# Altium schematic sheet SH3-POWER.SchDoc: SH4-POWER
size Letter; DrawnBy: Christopher Arjune; SheetNumber: 4; SheetTotal: 4
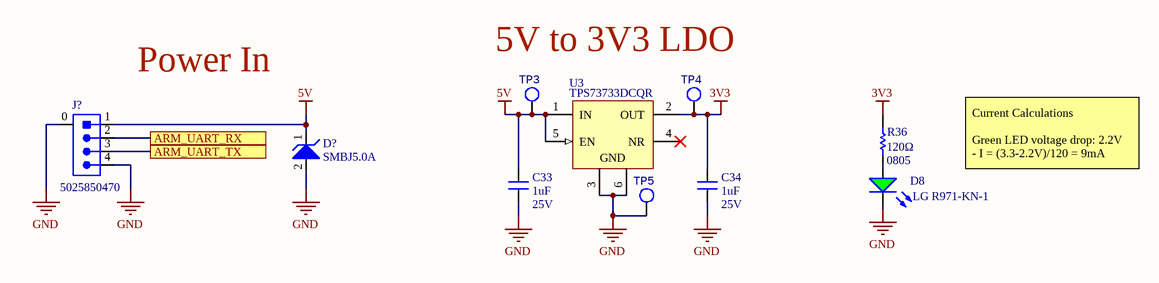
[diagram p0: SH3-POWER.SchDoc]

## Parts
C33  Capacitance: 1uF  Voltage Rating (DC): 25V  [CAPC2012X140N]
C34  Capacitance: 1uF  Voltage Rating (DC): 25V  [CAPC2012X140N]
D8  LG R971-KN-1  [LED_0805_LINE]
D?  TVS_DIODE_UNIDIR_5V  [SMBJ5.0A]  (value not drawn)
J?  Manufactor Number: 5025850470  [MOLEX-5025850470]  (hidden comment: CON_4M_SM_RA)
R36  Case Code (Imperial): 0805  Resistance: 120Ω  [RESC2012X60N]  (hidden comment: 120)
TP3  TESTPOINT_LOOP  [TESTPOINT_LOOP]  (value not drawn)
TP4  TESTPOINT_LOOP  [TESTPOINT_LOOP]  (value not drawn)
TP5  TESTPOINT_LOOP  [TESTPOINT_LOOP]  (value not drawn)
U3  TPS73733DCQR  [SOT-223-6]

## Ports
ARM_UART_RX, ARM_UART_TX

## Nets
3V3: C34.2 R36.2 TP4.1 U3.2(OUT)
5V: C33.1 D?.1 J?.1 TP3.1 U3.1(IN) U3.5(EN)
GND: C33.2 C34.1 D8.2(K) D?.2 J?.0 J?.4 TP5.1 U3.3(GND) U3.6(GND)
ARM_UART_RX: J?.2 ; port ARM_UART_RX
ARM_UART_TX: J?.3 ; port ARM_UART_TX
NetD8_1: D8.1(A) R36.1

Not connected (* = marked no-connect by the designer): U3 4(NR)*

## Notes on the sheet
- 5V to 3V3 LDO
- Power In
- Current Calculations
  Green LED voltage drop: 2.2V
  - I = (3.3-2.2V)/120 = 9mA
- Title
- Size:
- Date:
- Letter
- Drawn By:
- Sheet
- of
- File:

## Library data of the parts
C33 C34 = CAP_1uF_25V_0805: CAP CER 1UF 25V X7R 0805; Manufacturer 1: Murata; Manufacturer Part Number 1: GCM21BR71E105KA56K; Tolerance: 10%; Supplier 1: Digi-Key; Stock 1: 31473; Pricing 1: 1=0.34000, 10=0.23600, 100=0.13360, 500=0.09432, 1000=0.08254, 2500=0.07861, 5000=0.07271 (USD); RoHS: Yes; Mount: Surface Mount; Case/Package: 0805; Case Code (Metric): 2012; Case Code (Imperial): 0805; Min Operating Temperature: -55°C; Max Operating Temperature: 125°C; Package Quantity: 10000; Voltage Rating: 25V; Packaging: Tape and Reel; Dielectric: X7R; Termination: SMD/SMT; Length: 2mm; Height: 1.25mm; Width: 0.049inch; Thickness: 0.055inch; Depth: 1.25mm; Ratings: AEC-Q200; Radiation Hardening: No; ComponentLink1URL: https://datasheet.ciiva.com/169/product-169236.pdf?src-supplier=Digi-Key; ComponentLink1Description: https://datasheet.ciiva.com/169/product-169236.pdf?src-supplier=Digi-Key; ComponentLink2URL: https://datasheet.ciiva.com/11616/product-11616618.pdf?src-supplier=Avnet; ComponentLink2Description: https://datasheet.ciiva.com/11616/product-11616618.pdf?src-supplier=Avnet; Supplier Part Number 1: 490-14743-1-ND
D8 = DIO_LED_G: LED GREEN DIFFUSED 0805 SMD; Manufacturer 1: OSRAM; Forward Voltage Drop: 2.2V; Package: 0805 (2012 Metric); Manufacturer Part Number 1: LG R971-KN-1; Supplier Part Number 1: 475-1410-1-ND; Supplier 1: Digi-Key; Mount: Surface Mount
D? = TVS_DIODE_UNIDIR_5V: TVS DIODE 5V 9.2V DO214AA; Manufacturer 1: Bourns; Operating Supply Voltage: 3.5V; Max Surge Current: 100A; Reverse Breakdown Voltage: 6.4V; Peak Pulse Power: 600W; Power Line Protection: No; Breakdown Voltage: 7.25V; Number of Channels: 1; Polarity: Unidirectional; Max Reverse Leakage Current: 800uA; Test Current: 10mA; Peak Pulse Current: 65.2A; Supplier 1: Digi-Key; Mount: Surface Mount; Number of Pins: 2; Min Operating Temperature: -55°C; Max Operating Temperature: 150°C; Reverse Standoff Voltage: 5V; Clamping Voltage: 9.2V; Max Power Dissipation: 600W; Max Breakdown Voltage: 7.25V; Leakage Current: 800uA; Composition: Zener; Supplier Part Number 1: SMBJ5.0ABCT-ND; Zener Voltage: *; Min Breakdown Voltage: 6.4V; Manufacturer Part Number 1: SMBJ5.0A
J? = CON_4M_SM_RA: CONN HEADER SMD RIGHT ANGLE 1.5 MM PITCH; Manufacturer: Molex; Supplier 1: Digi-Key; Supplier Part Number 1: WM9449CT-ND
R36 = RES_120Ω_0805: RES SMD 120 OHM 1% 1/8W 0805; Manufacturer 1: Vishay; Manufacturer Part Number 1: CRCW0805120RFKEA; Power Rating: 125mW; Voltage Rating: 150V; ComponentLink1URL: https://datasheet.ciiva.com/11810/0900766b80d98b26-11810477.pdf?src-supplier=RSComponents; ComponentLink1Description: https://datasheet.ciiva.com/11810/0900766b80d98b26-11810477.pdf?src-supplier=RSComponents; ComponentLink2URL: https://datasheet.ciiva.com/3258/dcrcwe3-3258069.pdf?src-supplier=Avnet; ComponentLink2Description: https://datasheet.ciiva.com/3258/dcrcwe3-3258069.pdf?src-supplier=Avnet; ComponentLink3URL: https://datasheet.ciiva.com/26317/fld-crcw-e3-data-en-26317334.pdf?src-supplier=Distrelec; ComponentLink3Description: https://datasheet.ciiva.com/26317/fld-crcw-e3-data-en-26317334.pdf?src-supplier=Distrelec; ComponentLink4URL: https://datasheet.ciiva.com/2467/dcrcwe3-2467512.pdf?src-supplier=Digi-Key; ComponentLink4Description: https://datasheet.ciiva.com/2467/dcrcwe3-2467512.pdf?src-supplier=Digi-Key; ComponentLink5URL: https://datasheet.ciiva.com/2467/dcrcwe3-2467514.pdf?src-supplier=Digi-Key; ComponentLink5Description: https://datasheet.ciiva.com/2467/dcrcwe3-2467514.pdf?src-supplier=Digi-Key; ComponentLink6URL: https://datasheet.ciiva.com/16211/dcrcwe3-16211931.pdf?src-supplier=Future+Electronics; ComponentLink6Description: https://datasheet.ciiva.com/16211/dcrcwe3-16211931.pdf?src-supplier=Future+Electronics; ComponentLink7URL: https://datasheet.ciiva.com/2467/dcrcwe3-2467513.pdf?src-supplier=Digi-Key; ComponentLink7Description: https://datasheet.ciiva.com/2467/dcrcwe3-2467513.pdf?src-supplier=Digi-Key; ComponentLink8URL: https://datasheet.ciiva.com/16852/dcrcwe3-16852841.pdf?src-supplier=Avnet+Europe; ComponentLink8Description: https://datasheet.ciiva.com/16852/dcrcwe3-16852841.pdf?src-supplier=Avnet+Europe; ComponentLink9URL: https://datasheet.ciiva.com/7777/1697337-7777354.pdf?src-supplier=Element14; ComponentLink9Description: https://datasheet.ciiva.com/7777/1697337-7777354.pdf?src-supplier=Element14; ComponentLink10URL: https://datasheet.ciiva.com/16788/70201119-16788154.pdf?src-supplier=Allied+Electronics; ComponentLink10Description: https://datasheet.ciiva.com/16788/70201119-16788154.pdf?src-supplier=Allied+Electronics; ComponentLink11URL: https://datasheet.ciiva.com/7777/1720486-7777567.pdf?src-supplier=Element14; ComponentLink11Description: https://datasheet.ciiva.com/7777/1720486-7777567.pdf?src-supplier=Element14; Supplier 1: Digi-Key; Mount: Surface Mount; Case Code (Metric): 2012; Supplier Part Number 1: 541-120CCT-ND; Package: 0805 (2012 Metric)
TP3-TP5 = TESTPOINT_LOOP: Loop testpoint through-hole pad; Manufacturer 1: Keystone Electronics; Manufacturer Part Number 1: 5002; Supplier Part Number 1: 36-5002-ND; Supplier 1: Digi-Key; Mount: Through Hole
U3 = CMP-0395-00300-2: IC REG LINEAR 3.3V 1A SOT223-6; Manufacturer: Texas Instruments; Fixed Output Options(V): 3.3; Vdo(Typ)(mV): 130; Iout(Max)(A): 1; Accuracy(%): 3; SubFamily: Single Channel LDO; Eco-Plan: Green (RoHS & no Sb/Br); Vin(Min)(V): 2.2; Vin(Max)(V): 5.5; Rating: Catalog; Iq(Typ)(mA): 0.3; PartNumber: TPS73733DCQR; DatasheetVersion: SBVS067O; PackageReference: DCQ0006A; PackageDescription: 6-Pin Plastic Small Outline, Body 3.5 x 6.5 mm, Pitch 1.27 mm; PackageVersion: 4202109/D; Vout Adj(Min)(V): 3.3; Vout Adj(Max)(V): 3.3; Mounting Technology: Surface Mount; Supplier 1: Digi-Key; Supplier Part Number 1: 296-22681-2-ND; Manufacturer 1: Texas Instruments; Manufacturer Part Number 1: TPS73733DCQR